# EAGLE schematic stm v0.4 (EAGLE 9.4.2)
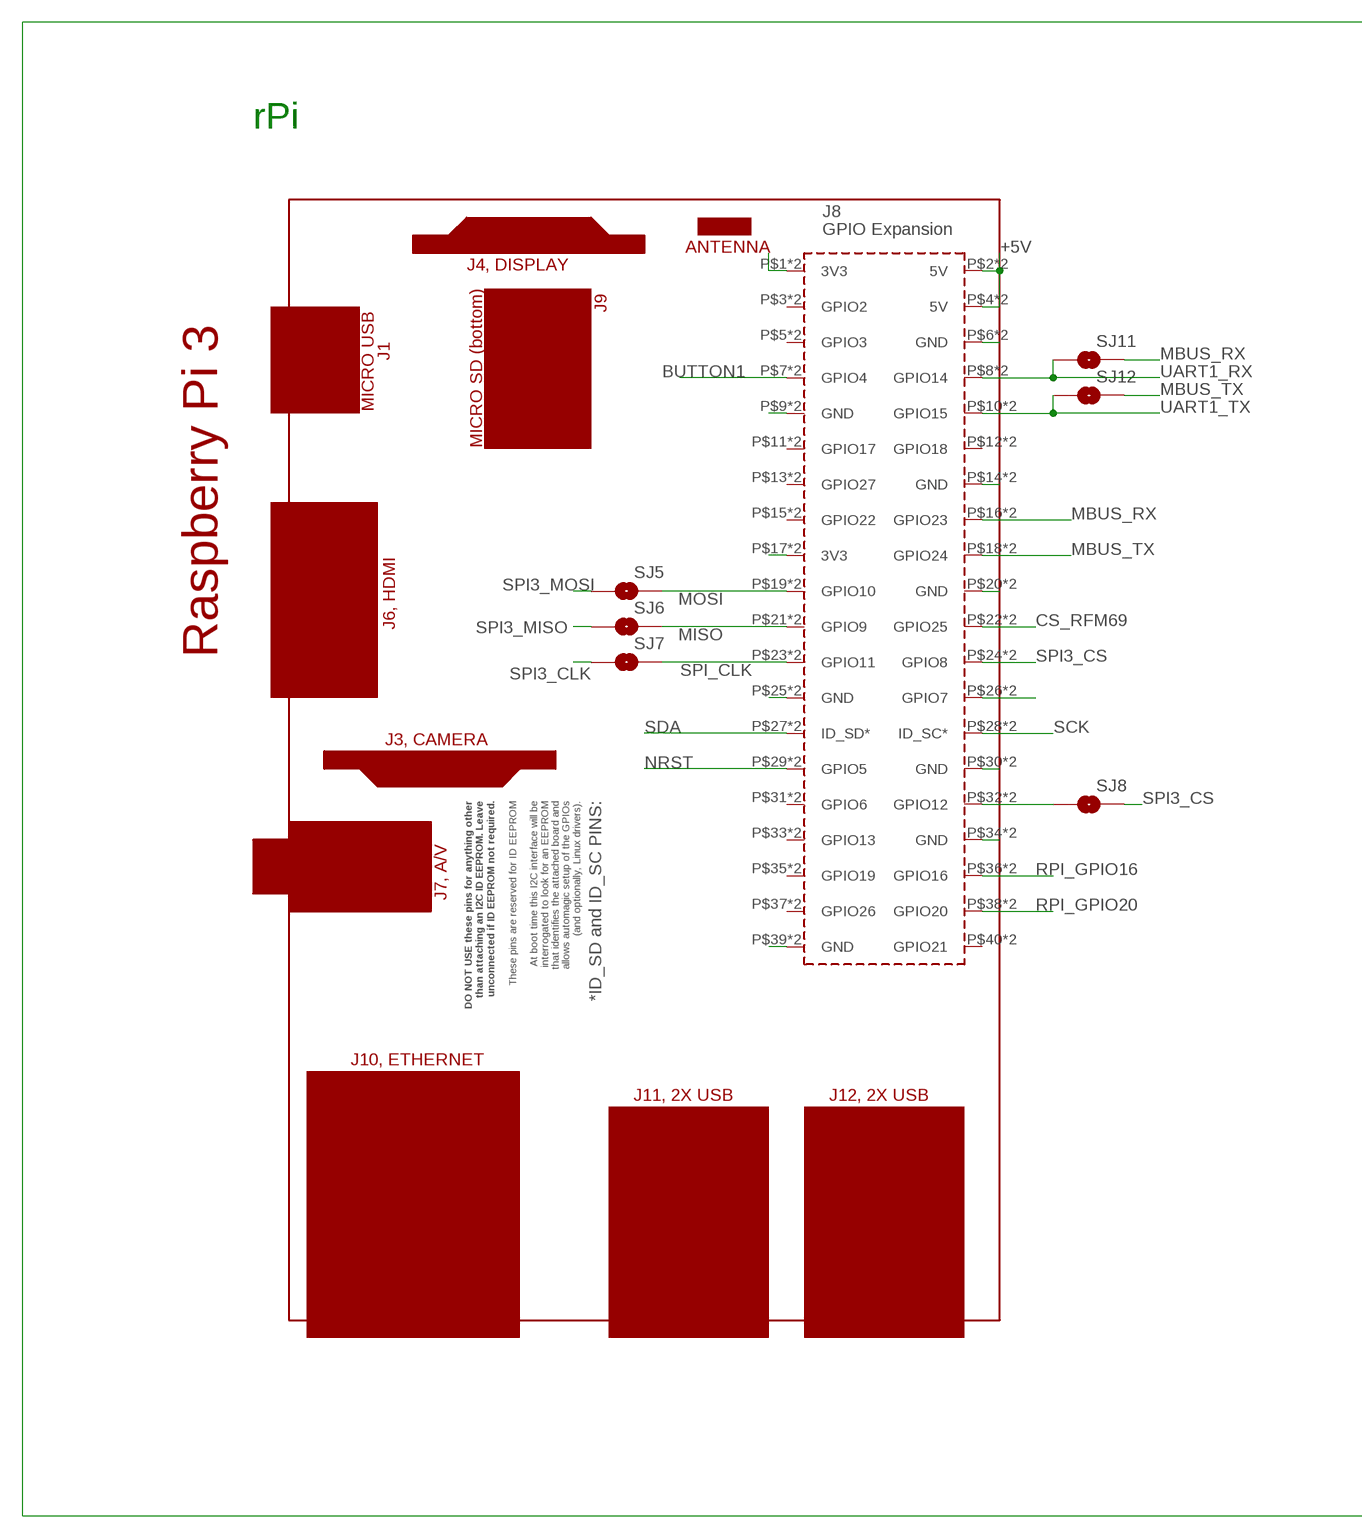
[diagram p0: schematic, sheet 1, part 1 of 2]
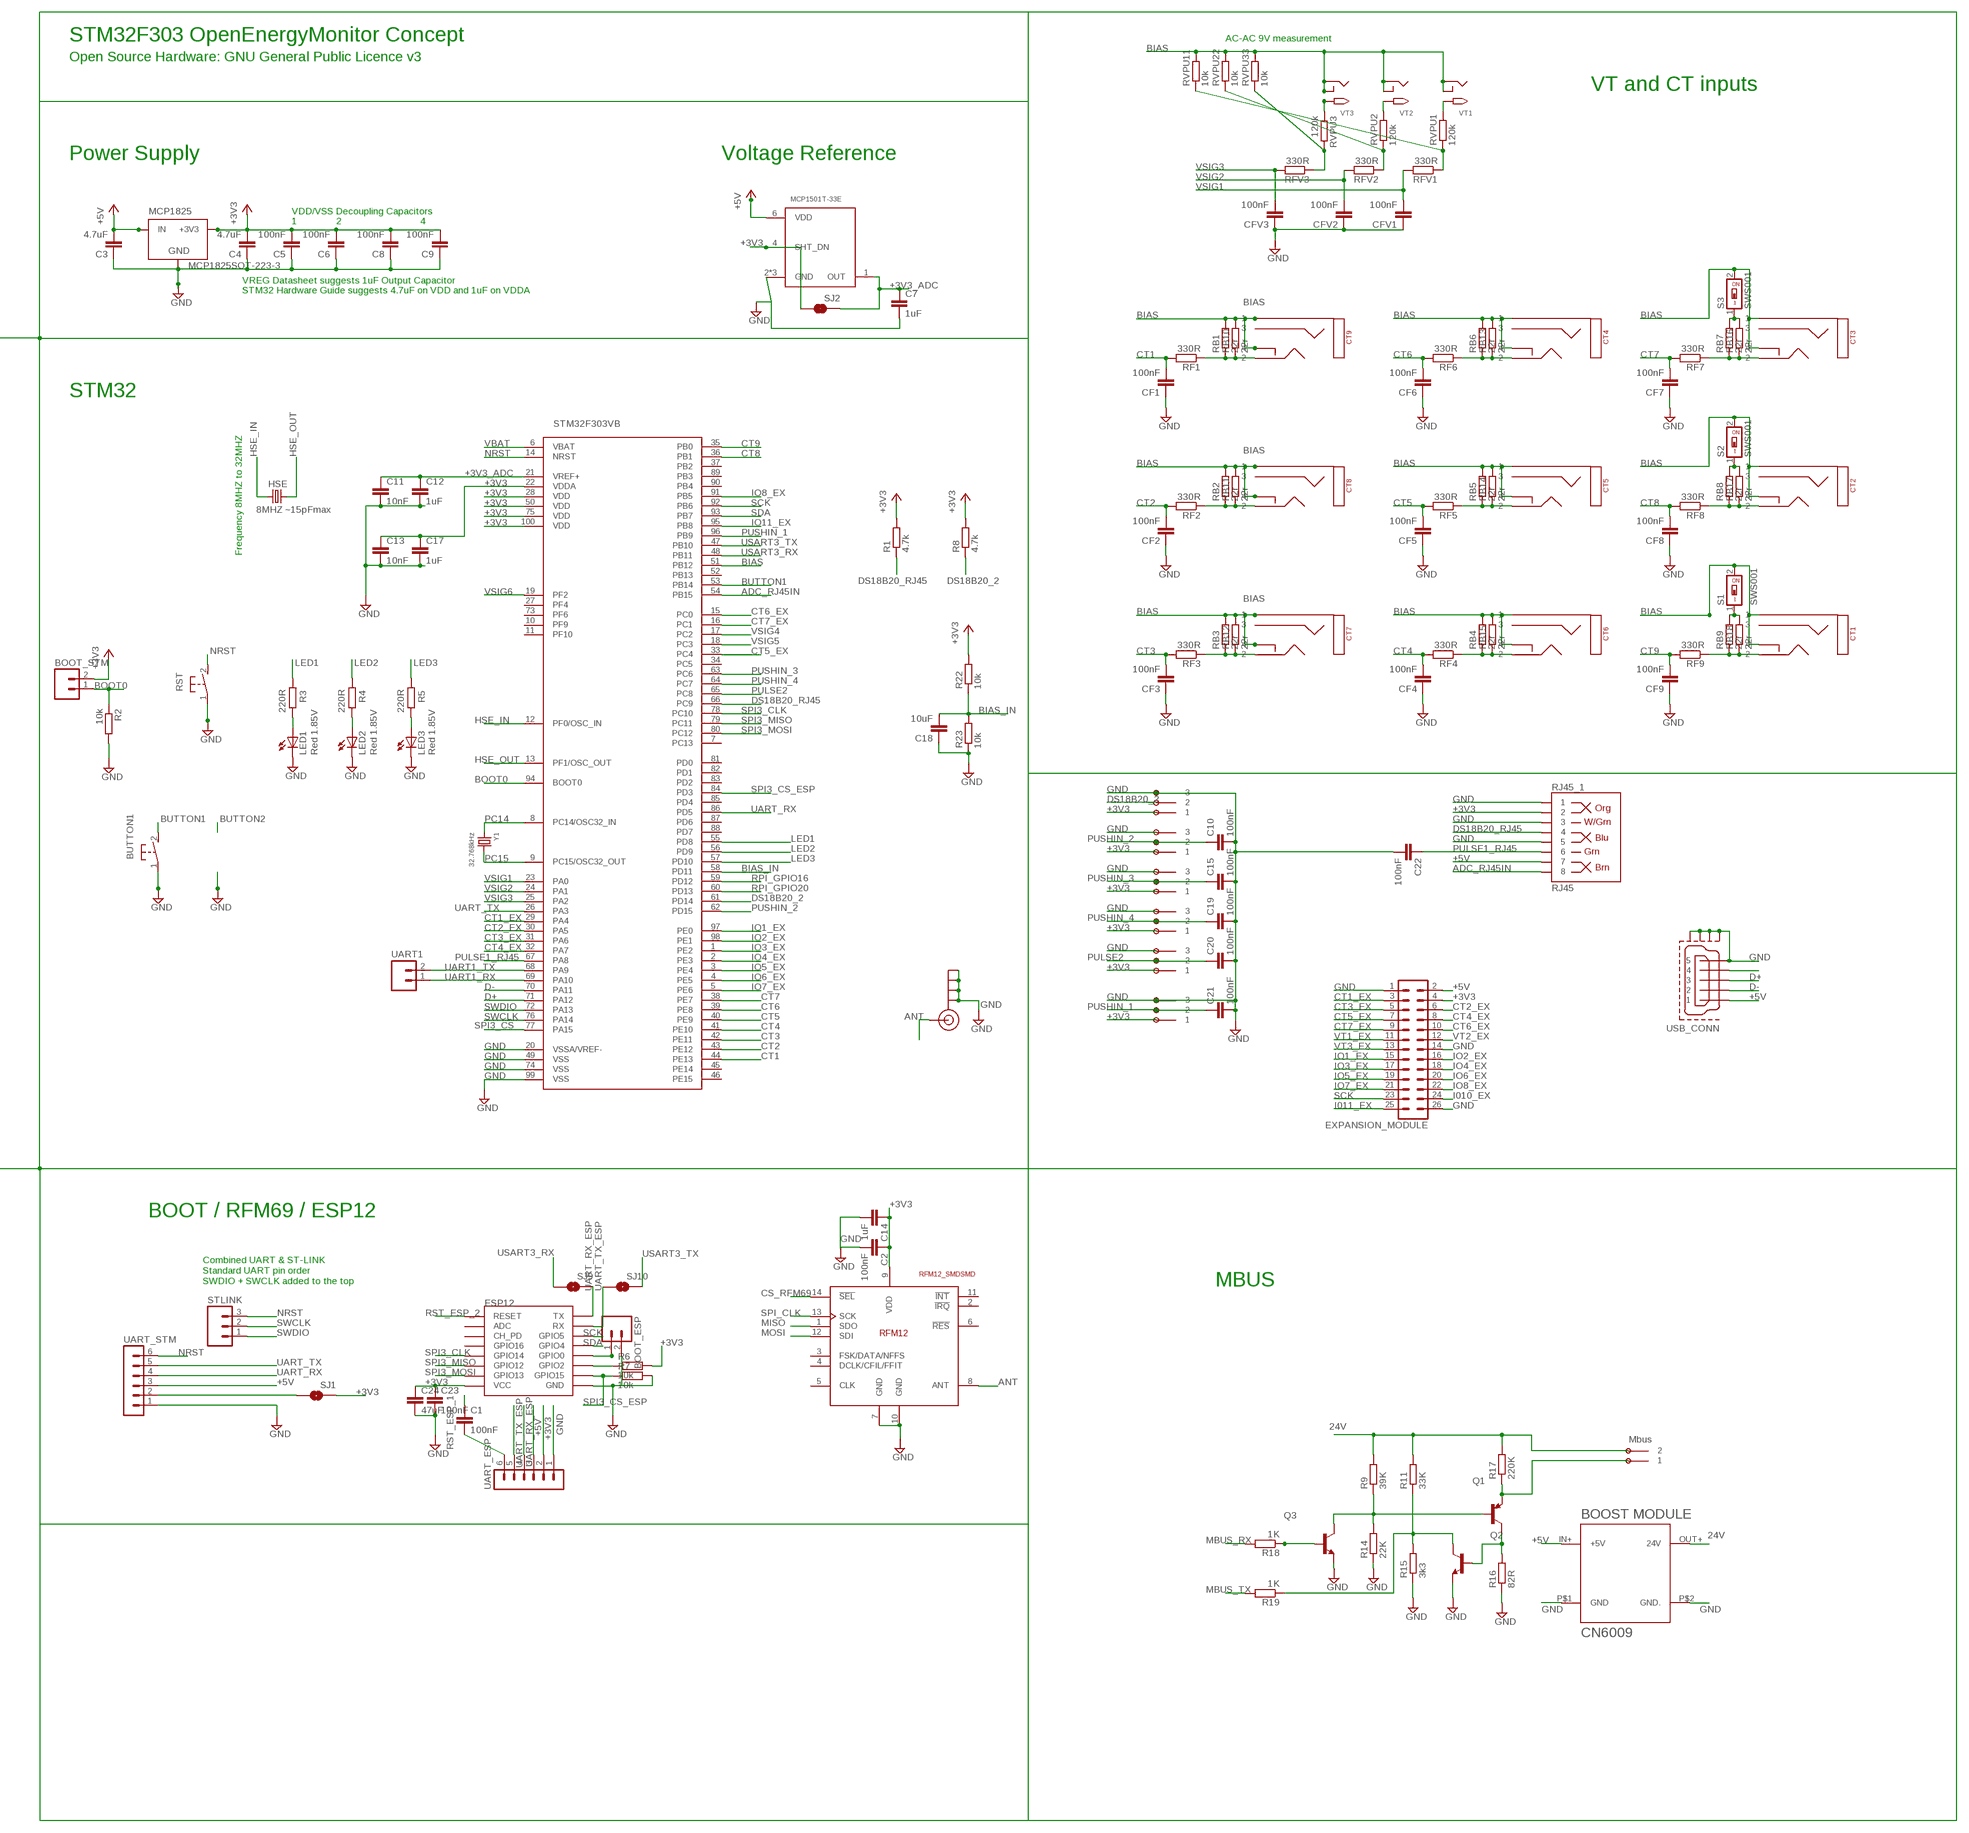
[diagram p1: schematic, sheet 1, part 2 of 2]

## Parts
2POLE_MBUS  OMNIMATE_LSF_2  [OMNIMATE_LSF_2]
3POLE_1  OMNIMATE_LSF_3  [OMNIMATE_LSF_3]
3POLE_2  OMNIMATE_LSF_3  [OMNIMATE_LSF_3]
3POLE_3  OMNIMATE_LSF_3  [OMNIMATE_LSF_3]
3POLE_4  OMNIMATE_LSF_3  [OMNIMATE_LSF_3]
3POLE_5  OMNIMATE_LSF_3  [OMNIMATE_LSF_3]
3POLE_6  OMNIMATE_LSF_3  [OMNIMATE_LSF_3]
BOOT_ESP  M02PTH  [1X02]
BOOT_STM  M02PTH  [1X02]
BUTTON1  31-XX  [B3F-31XX]
C1  100nF  C-EUC0603  [C0603]
C2  100nF  C-EUC0603  [C0603]
C3  4.7uF  C-EUC0805  [C0805]
C4  4.7uF  C-EUC0805  [C0805]
C5  100nF  C-EUC0603  [C0603]
C6  100nF  C-EUC0603  [C0603]
C7  1uF  C-EUC0805  [C0805]
C8  100nF  C-EUC0603  [C0603]
C9  100nF  C-EUC0603  [C0603]
C10  100nF  C-EUC0603  [C0603]
C11  10nF  C-EUC0603  [C0603]
C12  1uF  C-EUC0603  [C0603]
C13  10nF  C-EUC0603  [C0603]
C14  1uF  C-EUC0805  [C0805]
C15  100nF  C-EUC0603  [C0603]
C17  1uF  C-EUC0603  [C0603]
C18  10uF  C-EUC0603  [C0603]
C19  100nF  C-EUC0603  [C0603]
C20  100nF  C-EUC0603  [C0603]
C21  100nF  C-EUC0603  [C0603]
C22  100nF  C-EUC0603  [C0603]
C23  100nF  C-EUC0603  [C0603]
C24  47uF  C-EUC0805  [C0805]
CF1  100nF  C-EUC0603  [C0603]
CF2  100nF  C-EUC0603  [C0603]
CF3  100nF  C-EUC0603  [C0603]
CF4  100nF  C-EUC0603  [C0603]
CF5  100nF  C-EUC0603  [C0603]
CF6  100nF  C-EUC0603  [C0603]
CF7  100nF  C-EUC0603  [C0603]
CF8  100nF  C-EUC0603  [C0603]
CF9  100nF  C-EUC0603  [C0603]
CFV1  100nF  C-EUC0603  [C0603]
CFV2  100nF  C-EUC0603  [C0603]
CFV3  100nF  C-EUC0603  [C0603]
CT1  STEREO_SMD  [STEREO_SMT]
CT2  STEREO_SMD  [STEREO_SMT]
CT3  STEREO_SMD  [STEREO_SMT]
CT4  STEREO_SMD  [STEREO_SMT]
CT5  STEREO_SMD  [STEREO_SMT]
CT6  STEREO_SMD  [STEREO_SMT]
CT7  STEREO_SMD  [STEREO_SMT]
CT8  STEREO_SMD  [STEREO_SMT]
CT9  STEREO_SMD  [STEREO_SMT]
ESP12  ESP12SMD  [ESP12-SMD]
EXPANSION_MODULE  MA13-2  [MA13-2]
HSE  8MHZ ~15pFmax  CRYSTALCTS406  [CTS406]
J$1  SMA_EDGE  [SMA-EDGE]
LED1  Red 1.85V  LEDCHIP-LED0805  [CHIP-LED0805]
LED2  Red 1.85V  LEDCHIP-LED0805  [CHIP-LED0805]
LED3  Red 1.85V  LEDCHIP-LED0805  [CHIP-LED0805]
MCP1825  MCP1825SOT-223-3  [SOT-223]
PCB2  RPI3YA  [RPI3MIRROR2]
Q1  MMBT3906  [SOT23]
Q2  MMBT3904  [SOT23]
Q3  MMBT3904  [SOT23]
R1  4.7k  R-EU_R0603  [R0603]
R2  10k  R-EU_R0603  [R0603]
R3  220R  R-EU_R0603  [R0603]
R4  220R  R-EU_R0603  [R0603]
R5  220R  R-EU_R0603  [R0603]
R6  10k  R-EU_R0603  [R0603]
R7  10k  R-EU_R0603  [R0603]
R8  4.7k  R-EU_R0603  [R0603]
R9  39K  R-EU_R0603  [R0603]
R11  33K  R-EU_R0603  [R0603]
R14  22K  R-EU_R0603  [R0603]
R15  3k3  R-EU_R0603  [R0603]
R16  82R  R-EU_R0603  [R0603]
R17  220K  R-EU_R0603  [R0603]
R18  1K  R-EU_R0603  [R0603]
R19  1K  R-EU_R0603  [R0603]
R22  10k  R-EU_R0603  [R0603]
R23  10k  R-EU_R0603  [R0603]
RB1  22r  R-EU_R0603  [R0603]
RB2  22r  R-EU_R0603  [R0603]
RB3  22r  R-EU_R0603  [R0603]
RB4  22r  R-EU_R0603  [R0603]
RB5  22r  R-EU_R0603  [R0603]
RB6  22r  R-EU_R0603  [R0603]
RB7  22r  R-EU_R0603  [R0603]
RB8  22r  R-EU_R0603  [R0603]
RB9  22r  R-EU_R0603  [R0603]
RB10  22r  R-EU_0207/7  [0207/7]
RB11  22r  R-EU_0207/7  [0207/7]
RB12  22r  R-EU_0207/7  [0207/7]
RB13  22r  R-EU_0207/7  [0207/7]
RB14  22r  R-EU_0207/7  [0207/7]
RB15  22r  R-EU_0207/7  [0207/7]
RB16  22r  R-EU_0207/7  [0207/7]
RB17  22r  R-EU_0207/7  [0207/7]
RB18  22r  R-EU_0207/7  [0207/7]
RF1  330R  R-EU_R0603  [R0603]
RF2  330R  R-EU_R0603  [R0603]
RF3  330R  R-EU_R0603  [R0603]
RF4  330R  R-EU_R0603  [R0603]
RF5  330R  R-EU_R0603  [R0603]
RF6  330R  R-EU_R0603  [R0603]
RF7  330R  R-EU_R0603  [R0603]
RF8  330R  R-EU_R0603  [R0603]
RF9  330R  R-EU_R0603  [R0603]
RFM69HCW  RFM12_SMDSMD  [RFM12]
RFV1  330R  R-EU_R0603  [R0603]
RFV2  330R  R-EU_R0603  [R0603]
RFV3  330R  R-EU_R0603  [R0603]
RJ45_1  RJ45  RJ45-8  [RJ45-8]
RST  31-XX  [B3F-31XX]
RVPU1  120k  R-EU_R0603  [R0603]
RVPU2  120k  R-EU_R0603  [R0603]
RVPU3  120k  R-EU_R0603  [R0603]
RVPU11  10k  R-EU_R0603  [R0603]
RVPU22  10k  R-EU_R0603  [R0603]
RVPU33  10k  R-EU_R0603  [R0603]
S1  SWS001  [SMS-001]
S2  SWS001  [SMS-001]
S3  SWS001  [SMS-001]
SJ1  SOLDERJUMPERNO  [SJ_2S-NO]
SJ2  SOLDERJUMPERNO  [SJ_2S-NO]
SJ5  SOLDERJUMPERNO  [SJ_2S-NO]
SJ6  SOLDERJUMPERNO  [SJ_2S-NO]
SJ7  SOLDERJUMPERNO  [SJ_2S-NO]
SJ8  SOLDERJUMPERNO  [SJ_2S-NO]
SJ9  SOLDERJUMPERNO  [SJ_2S-NO]
SJ10  SOLDERJUMPERNO  [SJ_2S-NO]
SJ11  SOLDERJUMPERNO  [SJ_2S-NO]
SJ12  SOLDERJUMPERNO  [SJ_2S-NO]
STLINK  M03PTH  [1X03]
STM32F303VB  STM32F303XB  [TQFP100]
U$2  BOOST_MODULE  [BOOST]
UART1  M02PTH  [1X02]
UART_ESP  MA06-1  [MA06-1]
UART_STM  MA06-1  [MA06-1]
USB_CONN  MICRO-USB-RECEPTACLE47589-0001  [47589-0001]
VREF_3V3  MCP1501T-33E  [SOT95P280X145-6N]
VT1  2.1MMJACKSMT  [DCJACK_2MM_SMT]
VT2  2.1MMJACKSMT  [DCJACK_2MM_SMT]
VT3  2.1MMJACKSMT  [DCJACK_2MM_SMT]
Y1  32.768kHz  CRYSTAL8X3.8SMT  [CRYSTAL_8X3.8]

## Nets
24V: 2POLE_MBUS.P$3 2POLE_MBUS.P$4 R9.2 R11.2 R17.2 U$2.OUT+(24V)
+3V3 [power]: 3POLE_1.P$1 3POLE_1.P$2 3POLE_2.P$1 3POLE_2.P$2 3POLE_3.P$1 3POLE_3.P$2 3POLE_4.P$1 3POLE_4.P$2 3POLE_5.P$1 3POLE_5.P$2 3POLE_6.P$1 3POLE_6.P$2 BOOT_STM.2 C2.1 C4.2 C5.2 C6.2 C8.2 C9.2 C13.1 C14.1 C17.1 C23.1 C24.1 ESP12.VCC EXPANSION_MODULE.4 MCP1825.3(+3V3) R1.2 R6.2 R8.2 R22.2 RFM69HCW.9(VDD) RJ45_1.2 SJ1.2 SJ2.1 STM32F303VB.22(VDDA) STM32F303VB.28(VDD) STM32F303VB.50(VDD) STM32F303VB.75(VDD) STM32F303VB.100(VDD) UART_ESP.2 VREF_3V3.4(SHT_DN)
+3V3_ADC: C7.1 C11.1 C12.1 SJ2.2 STM32F303VB.21(VREF+) VREF_3V3.1(OUT)
+5V [power]: C3.2 EXPANSION_MODULE.2 MCP1825.1(IN) PCB2.P$2(5V) PCB2.P$4(5V) PCB2.P$42(5V) PCB2.P$44(5V) RJ45_1.7 U$2.IN+(+5V) UART_ESP.3 UART_STM.3 USB_CONN.1 VREF_3V3.6(VDD)
AC1: RVPU1.2 VT1.PWR2(TIP)
AC2: RVPU2.2 VT2.PWR2(TIP)
AC3: RVPU3.1 VT3.PWR2(TIP)
ADC0: RFV3.1 RVPU3.2 RVPU33.1
ADC_RJ45IN: RJ45_1.8 STM32F303VB.54(PB15)
ANT: J$1.SIG(SIGNAL) RFM69HCW.8(ANT)
BIAS: CT1.P$1 CT1.P$4 CT2.P$1 CT2.P$4 CT3.P$1 CT3.P$4 CT4.P$1 CT4.P$4 CT5.P$1 CT5.P$4 CT6.P$1 CT6.P$4 CT7.P$1 CT7.P$4 CT8.P$1 CT8.P$4 CT9.P$1 CT9.P$4 RB1.2 RB2.2 RB3.2 RB4.2 RB5.2 RB6.2 RB10.2 RB11.2 RB12.2 RB13.2 RB14.2 RB15.2 RVPU11.2 RVPU22.2 RVPU33.2 S1.2 S2.2 S3.2 STM32F303VB.51(PB12) VT1.GND(RING) VT1.GNDBREAK(RING_SW) VT2.GND(RING) VT2.GNDBREAK(RING_SW) VT3.GND(RING) VT3.GNDBREAK(RING_SW)
BIAS_IN: C18.2 R22.1 R23.2 STM32F303VB.58(PD11)
BOOT0: BOOT_STM.1 R2.1 STM32F303VB.94(BOOT0)
BUTTON1: BUTTON1.2(S) PCB2.P$7(GPIO4) PCB2.P$47(GPIO4) STM32F303VB.53(PB14)
CS_RFM69: PCB2.P$22(GPIO25) PCB2.P$62(GPIO25) RFM69HCW.14(!SEL)
CT1: CF1.2 RF1.2 STM32F303VB.44(PE13)
CT1_EX: EXPANSION_MODULE.3 STM32F303VB.29(PA4)
CT2: CF2.2 RF2.2 STM32F303VB.43(PE12)
CT2_EX: EXPANSION_MODULE.6 STM32F303VB.30(PA5)
CT3: CF3.2 RF3.2 STM32F303VB.42(PE11)
CT3_EX: EXPANSION_MODULE.5 STM32F303VB.31(PA6)
CT4: CF4.2 RF4.2 STM32F303VB.41(PE10)
CT4_EX: EXPANSION_MODULE.8 STM32F303VB.32(PA7)
CT5: CF5.2 RF5.2 STM32F303VB.40(PE9)
CT5_EX: EXPANSION_MODULE.7 STM32F303VB.33(PC4)
CT6: CF6.2 RF6.2 STM32F303VB.39(PE8)
CT6_EX: EXPANSION_MODULE.10 STM32F303VB.15(PC0)
CT7: CF7.2 RF7.2 STM32F303VB.38(PE7)
CT7_EX: EXPANSION_MODULE.9 STM32F303VB.16(PC1)
CT8: CF8.2 RF8.2 STM32F303VB.36(PB1)
CT9: CF9.2 RF9.2 STM32F303VB.35(PB0)
D+: STM32F303VB.71(PA12) USB_CONN.3
D-: STM32F303VB.70(PA11) USB_CONN.2
DS18B20_2: 3POLE_1.P$3 3POLE_1.P$4 R8.1 STM32F303VB.61(PD14)
DS18B20_RJ45: R1.1 RJ45_1.4 STM32F303VB.66(PC9)
GND [power]: 3POLE_1.P$5 3POLE_1.P$6 3POLE_2.P$5 3POLE_2.P$6 3POLE_3.P$5 3POLE_3.P$6 3POLE_4.P$5 3POLE_4.P$6 3POLE_5.P$5 3POLE_5.P$6 3POLE_6.P$5 3POLE_6.P$6 BOOT_ESP.2 BUTTON1.1(P) C2.2 C3.1 C4.1 C5.1 C6.1 C7.2 C8.1 C9.1 C10.2 C11.2 C12.2 C13.2 C14.2 C15.2 C17.2 C18.1 C19.2 C20.2 C21.2 C22.2 C23.2 C24.2 CF1.1 CF2.1 CF3.1 CF4.1 CF5.1 CF6.1 CF7.1 CF8.1 CF9.1 CFV1.1 CFV2.1 CFV3.1 ESP12.GND EXPANSION_MODULE.1 EXPANSION_MODULE.14 EXPANSION_MODULE.26 J$1.GND@0(GND) J$1.GND@1(GND) J$1.GND@2(GND) J$1.GND@3(GND) LED1.C LED2.C LED3.C MCP1825.2(GND) MCP1825.4(GND) PCB2.P$6(GND) PCB2.P$9(GND) PCB2.P$14(GND) PCB2.P$20(GND) PCB2.P$25(GND) PCB2.P$30(GND) PCB2.P$34(GND) PCB2.P$39(GND) PCB2.P$46(GND) PCB2.P$49(GND) PCB2.P$54(GND) PCB2.P$60(GND) PCB2.P$65(GND) PCB2.P$70(GND) PCB2.P$74(GND) PCB2.P$79(GND) Q2.2(E) Q3.2(E) R2.2 R7.2 R14.1 R15.1 R16.1 R23.1 RFM69HCW.7(GND) RFM69HCW.10(GND) RJ45_1.1 RJ45_1.3 RJ45_1.5 RST.1(P) STM32F303VB.20(VSSA/VREF-) STM32F303VB.49(VSS) STM32F303VB.74(VSS) STM32F303VB.99(VSS) U$2.P$1(GND) U$2.P$2(GND.) UART_ESP.1 UART_STM.1 USB_CONN.5 USB_CONN.CASING1(GND1) USB_CONN.CASING2(GND2) USB_CONN.CASING3(GND3) USB_CONN.CASING4(GND4) VREF_3V3.2(GND) VREF_3V3.3(GND) VREF_3V3.5(GND)
HSE_IN: HSE.1 STM32F303VB.12(PF0/OSC_IN)
HSE_OUT: HSE.3 STM32F303VB.13(PF1/OSC_OUT)
I010_EX: EXPANSION_MODULE.24
I011_EX: EXPANSION_MODULE.25
IO1_EX: EXPANSION_MODULE.15 STM32F303VB.97(PE0)
IO2_EX: EXPANSION_MODULE.16 STM32F303VB.98(PE1)
IO3_EX: EXPANSION_MODULE.17 STM32F303VB.1(PE2)
IO4_EX: EXPANSION_MODULE.18 STM32F303VB.2(PE3)
IO5_EX: EXPANSION_MODULE.19 STM32F303VB.3(PE4)
IO6_EX: EXPANSION_MODULE.20 STM32F303VB.4(PE5)
IO7_EX: EXPANSION_MODULE.21 STM32F303VB.5(PE6)
IO8_EX: EXPANSION_MODULE.22 STM32F303VB.91(PB5)
IO11_EX: STM32F303VB.95(PB8)
LED1: R3.2 STM32F303VB.55(PD8)
LED2: R4.2 STM32F303VB.56(PD9)
LED3: R5.2 STM32F303VB.57(PD10)
MBUS_RX: PCB2.P$16(GPIO23) PCB2.P$56(GPIO23) R18.2 SJ11.2
MBUS_TX: PCB2.P$18(GPIO24) PCB2.P$58(GPIO24) R19.2 SJ12.2
MISO: PCB2.P$21(GPIO9) PCB2.P$61(GPIO9) RFM69HCW.1(SDO) SJ6.2
MOSI: PCB2.P$19(GPIO10) PCB2.P$59(GPIO10) RFM69HCW.12(SDI) SJ5.2
N$1: SJ1.1 UART_STM.2
N$2: CT9.P$2 RB1.1 RB10.1 RF1.1
N$5: LED2.A R4.1
N$6: LED3.A R5.1
N$7: BOOT_ESP.1 ESP12.GPIO0
N$8: CT8.P$2 RB2.1 RB11.1 RF2.1
N$10: CT7.P$2 RB3.1 RB12.1 RF3.1
N$11: ESP12.GPIO2 R6.1
N$12: USB_CONN.4
N$13: PCB2.P$26(GPIO7) PCB2.P$66(GPIO7)
N$16: PCB2.P$32(GPIO12) PCB2.P$72(GPIO12) SJ8.1
N$22: PCB2.P$1(3V3) PCB2.P$41(3V3)
N$24: PCB2.P$17(3V3) PCB2.P$57(3V3)
N$26: RB9.2 RB18.2 S1.1
N$27: RB8.2 RB17.2 S2.1
N$28: RB7.2 RB16.2 S3.1
N$29: 2POLE_MBUS.P$1 2POLE_MBUS.P$2 Q1.2(E) R17.1
N$30: Q1.3(C) Q2.1(B) R16.2
N$31: Q1.1(B) Q3.3(C) R9.1 R14.2
N$32: Q2.3(C) R11.1 R15.2 R19.1
N$33: Q3.1(B) R18.1
N$34: RFV2.1 RVPU2.1 RVPU22.1
N$37: RFV1.1 RVPU1.1 RVPU11.1
N$38: CT6.P$2 RB4.1 RB15.1 RF4.1
N$39: CT5.P$2 RB5.1 RB14.1 RF5.1
N$40: CT4.P$2 RB6.1 RB13.1 RF6.1
N$41: LED1.A R3.1
N$42: CT3.P$2 RB7.1 RB16.1 RF7.1
N$43: CT2.P$2 RB8.1 RB17.1 RF8.1
N$44: CT1.P$2 RB9.1 RB18.1 RF9.1
NRST: PCB2.P$29(GPIO5) PCB2.P$69(GPIO5) RST.2(S) STLINK.3 STM32F303VB.14(NRST) UART_STM.6
PC14: STM32F303VB.8(PC14/OSC32_IN) Y1.P$1
PC15: STM32F303VB.9(PC15/OSC32_OUT) Y1.P$4
PULSE1_RJ45: C22.1 RJ45_1.6 STM32F303VB.67(PA8)
PULSE2: 3POLE_5.P$3 3POLE_5.P$4 C20.1 STM32F303VB.65(PC8)
PUSHIN_1: 3POLE_6.P$3 3POLE_6.P$4 C21.1 STM32F303VB.96(PB9)
PUSHIN_2: 3POLE_2.P$3 3POLE_2.P$4 C10.1 STM32F303VB.62(PD15)
PUSHIN_3: 3POLE_3.P$3 3POLE_3.P$4 C15.1 STM32F303VB.63(PC6)
PUSHIN_4: 3POLE_4.P$3 3POLE_4.P$4 C19.1 STM32F303VB.64(PC7)
RPI_GPIO16: PCB2.P$36(GPIO16) PCB2.P$76(GPIO16) STM32F303VB.59(PD12)
RPI_GPIO20: PCB2.P$38(GPIO20) PCB2.P$78(GPIO20) STM32F303VB.60(PD13)
RST_ESP_1: C1.2 UART_ESP.6
RST_ESP_2: C1.1 ESP12.RESET
SCK: ESP12.GPIO5 EXPANSION_MODULE.23 PCB2.P$28(ID_SC*) PCB2.P$68(ID_SC*) STM32F303VB.92(PB6)
SDA: ESP12.GPIO4 PCB2.P$27(ID_SD*) PCB2.P$67(ID_SD*) STM32F303VB.93(PB7)
SPI3_CLK: ESP12.GPIO14 SJ7.1 STM32F303VB.78(PC10)
SPI3_CS: PCB2.P$24(GPIO8) PCB2.P$64(GPIO8) SJ8.2 STM32F303VB.77(PA15)
SPI3_CS_ESP: ESP12.GPIO15 R7.1 STM32F303VB.84(PD3)
SPI3_MISO: ESP12.GPIO12 SJ6.1 STM32F303VB.79(PC11)
SPI3_MOSI: ESP12.GPIO13 SJ5.1 STM32F303VB.80(PC12)
SPI_CLK: PCB2.P$23(GPIO11) PCB2.P$63(GPIO11) RFM69HCW.13(SCK) SJ7.2
SWCLK: STLINK.2 STM32F303VB.76(PA14)
SWDIO: STLINK.1 STM32F303VB.72(PA13)
UART1_RX: PCB2.P$8(GPIO14) PCB2.P$48(GPIO14) SJ11.1 STM32F303VB.69(PA10) UART1.1
UART1_TX: PCB2.P$10(GPIO15) PCB2.P$50(GPIO15) SJ12.1 STM32F303VB.68(PA9) UART1.2
UART_RX: STM32F303VB.86(PD5) UART_STM.4
UART_RX_ESP: ESP12.TXD0(TX) SJ9.2 UART_ESP.4
UART_TX: STM32F303VB.26(PA3) UART_STM.5
UART_TX_ESP: ESP12.RXD0(RX) SJ10.1 UART_ESP.5
USART3_RX: SJ9.1 STM32F303VB.48(PB11)
USART3_TX: SJ10.2 STM32F303VB.47(PB10)
VBAT: STM32F303VB.6(VBAT)
VSIG1: CFV1.2 RFV1.2 STM32F303VB.23(PA0)
VSIG2: CFV2.2 RFV2.2 STM32F303VB.24(PA1)
VSIG3: CFV3.2 RFV3.2 STM32F303VB.25(PA2)
VSIG4: STM32F303VB.17(PC2)
VSIG5: STM32F303VB.18(PC3)
VSIG6: STM32F303VB.19(PF2)
VT1_EX: EXPANSION_MODULE.11
VT2_EX: EXPANSION_MODULE.12
VT3_EX: EXPANSION_MODULE.13
Unconnected: CT1.P$3 CT2.P$3 CT3.P$3 CT4.P$3 CT5.P$3 CT6.P$3 CT7.P$3 CT8.P$3 CT9.P$3 ESP12.ADC ESP12.CH_PD ESP12.GPIO16 PCB2.P$3(GPIO2) PCB2.P$5(GPIO3) PCB2.P$11(GPIO17) PCB2.P$12(GPIO18) PCB2.P$13(GPIO27) PCB2.P$15(GPIO22) PCB2.P$31(GPIO6) PCB2.P$33(GPIO13) PCB2.P$35(GPIO19) PCB2.P$37(GPIO26) PCB2.P$40(GPIO21) PCB2.P$43(GPIO2) PCB2.P$45(GPIO3) PCB2.P$51(GPIO17) PCB2.P$52(GPIO18) PCB2.P$53(GPIO27) PCB2.P$55(GPIO22) PCB2.P$71(GPIO6) PCB2.P$73(GPIO13) PCB2.P$75(GPIO19) PCB2.P$77(GPIO26) PCB2.P$80(GPIO21) RFM69HCW.2(!IRQ) RFM69HCW.3(FSK/DATA/NFFS) RFM69HCW.4(DCLK/CFIL/FFIT) RFM69HCW.5(CLK) RFM69HCW.6(!RES) RFM69HCW.11(!INT) STM32F303VB.7(PC13) STM32F303VB.10(PF9) STM32F303VB.11(PF10) STM32F303VB.27(PF4) STM32F303VB.34(PC5) STM32F303VB.37(PB2) STM32F303VB.45(PE14) STM32F303VB.46(PE15) STM32F303VB.52(PB13) STM32F303VB.73(PF6) STM32F303VB.81(PD0) STM32F303VB.82(PD1) STM32F303VB.83(PD2) STM32F303VB.85(PD4) STM32F303VB.87(PD6) STM32F303VB.88(PD7) STM32F303VB.89(PB3) STM32F303VB.90(PB4)

## Notes on the sheet
- STM32F303 OpenEnergyMonitor Concept | AC-AC 9V measurement
- Open Source Hardware: GNU General Public Licence v3
- VT and CT inputs
- Power Supply | Voltage Reference
- VDD/VSS Decoupling Capacitors
- 1 | 2 | 4
- VREG Datasheet suggests 1uF Output Capacitor
- STM32 Hardware Guide suggests 4.7uF on VDD and 1uF on VDDA
- rPi | STM32
- Frequency 8MHZ to 32MHZ
- BOOT / RFM69 / ESP12
- Combined UART & ST-LINK
  Standard UART pin order
  SWDIO + SWCLK added to the top
- MBUS
- Mbus

## Library data of the parts
2POLE_MBUS = OMNIMATE_LSF:OMNIMATE_LSF_2
3POLE_1-3POLE_6 = OMNIMATE_LSF:OMNIMATE_LSF_3
BOOT_ESP BOOT_STM UART1 = SparkFun:M02: Header 2 Standard 2-pin 0.1" header. Use with straight break away headers (SKU : PRT-00116), right angle break away headers (PRT-00553), swiss pins (PRT-00743), machine pins (PRT-00117), and female headers (PRT-00115). Molex polarized connector foot print use with SKU : PRT-08233 with associated crimp pins and housings.
BUTTON1 RST = switch-omron:31-XX: OMRON SWITCH; MPN: B3F-3100; OC_FARNELL: 959704; OC_NEWARK: 36M3582
C1 C2 C5 C6 C8-C10 C12 C15 C17-C23 CF1-CF9 CFV1-CFV3 = resistor:C-EU: CAPACITOR, European symbol
C3 C4 C7 C11 C13 C14 C24 = rcl:C-EU: CAPACITOR, European symbol; SPICEPREFIX: C
CT1-CT9 = IotaWatt_parts:STEREO_SMD: 3.5mm Stereo Jack SMT
ESP12 = ESP8266 MODULES _ CORRECTED:ESP12: ESP8266 Wifi module 12
EXPANSION_MODULE = con-lstb:MA13-2: PIN HEADER; OC_FARNELL: unknown; OC_NEWARK: unknown
HSE = crystal:CRYSTAL: CRYSTAL; OC_FARNELL: unknown; OC_NEWARK: unknown
J$1 = SparkFun-Connectors:SMA_EDGE: SMA Antenna Connector End launch SMA connector. The paste layer has been removed so that the connector can be hand soldered onto the board after reflow.
LED1-LED3 = adafruit:LED: LED OSRAM: - CHIPLED LG R971, LG N971, LY N971, LG Q971, LY Q971, LO R971, LY R971 LH N974, LH R974 LS Q976, LO Q976, LY Q976 LO Q996 - Hyper CHIPLED LW Q18S LB Q993, LB Q99A, LB R99A - SideLED LS A670, LO A670, LY A670, LG A670, LP A670 LB A673, LV A673, LT A673, LW A673 LH A674 LY A675 LS A676, LA A676, LO A676, LY A676, LW A676 LS A679, LY A679, LG A679 - Hyper Micro SIDELED® LS Y876, LA Y876, LO Y876, LY Y876 LT Y87S - SmartLED LW L88C, LW L88S LB L89C, LB L89S, LG L890 LS L89K, LO L89K, LY L89K LS L896, LA L896, LO L896, LY L896 - TOPLED LS T670, LO T670, LY T670, LG T670, LP T670 LSG T670, LSP T670, LSY T670, LOP T670, LYG T670 LG T671, LOG T671, LSG T671 LB T673, LV T673, LT T673, LW T673 LH T674 LS T676, LA T676, LO T676, LY T676, LB T676, LH T676, LSB T676, LW T676 LB T67C, LV T67C, LT T67C, LS T67K, LO T67K, LY T67K, LW E67C LS E67B, LA E67B, LO E67B, LY E67B, LB E67C, LV E67C, LT E67C LW T67C LS T679, LY T679, LG T679 LS T770, LO T770, LY T770, LG T770, LP T770 LB T773, LV T773, LT T773, LW T773 LH T774 LS E675, LA E675, LY E675, LS T675 LS T776, LA T776, LO T776, LY T776, LB T776 LHGB T686 LT T68C, LB T68C - Hyper Mini TOPLED® LB M676 - Mini TOPLED Santana® LG M470 LS M47K, LO M47K, LY M47K Source: http://www.osram.convergy.de/
MCP1825 = SteelCaveRobotics-Power:MCP1825: MCP1825 3.3v LDO Linear Regulator
PCB2 = e14_Rpi3_RevA+mirror-pcb copy:RPI3: Device for Raspberry Pi 3 board created by Dave Young for www.element14.com More information and support community is available at https://www.element14.com/community/community/raspberry-pi Device for Raspberry Pi 3 board updated by Gerald Schwarz for www.element14.com On RPI3 addet the layer milling and created a mirrored shield.
Q1 = Transistor:MMBT3906: TRANS PNP 40V 0.2A SOT-23; CREATED_BY: PCB Layout; DIGIKEY_PART_NUMBER: MMBT3906FSCT-ND; MANUFACTURER: ON Semiconductor; MPN: MMBT3906; PACKAGE: SOT-23
Q2 Q3 = Transistor:MMBT3904: TRANS NPN 40V 0.2A SOT-23; CREATED_BY: PCB Layout; DIGIKEY_PART_NUMBER: MMBT3904FSCT-ND; MANUFACTURER: ON Semiconductor; MPN: MMBT3904; PACKAGE: SOT-23-3
R1 R2 R6-R8 R22 R23 RB1-RB9 RF1-RF9 RFV1-RFV3 RVPU1-RVPU3 RVPU11 RVPU22 RVPU33 = resistor:R-EU_: RESISTOR, European symbol
R3-R5 R9 R11 R14-R19 RB10-RB18 = rcl:R-EU_: RESISTOR, European symbol; SPICEPREFIX: R
RFM69HCW = rfm12b _ rfm69cw:RFM12_SMD: RFM12 is a low costing ISM band transceiver module implemented with unique PLL. It works signal ranges from 315/433/868/915MHZ bands, comply with FCC, ETSI regulation. The SPI interface is used to communicate with microcontroller for parameter setting.
RJ45_1 = SparkFun-Connectors:RJ45-8: RJ45 Jack - 8 pin Simple RJ45, 8-pin connection. Commonly used for Cat5, Cat5e, and Cat6 Ethernet cables. Here is the connector we sell at SparkFun: RJ45 8-Pin Connector <https://www.sparkfun.com/products/643> (PRT-00643) Datasheet <https://cdn.sparkfun.com/datasheets/Prototyping/04908.pdf> It is used on this SparkFun product: SparkFun RJ45 Breakout <https://www.sparkfun.com/products/716> (BOB-00716) Note, you may also be interested in the "MAGJACK" version of this. It is basically a RJ45 connector, but also has some status LEDs built into the connector housing. You can check that out in this library at the device named "MAGJACK.dev" and see these products online: RJ45 Ethernet MagJack-Compatible <https://www.sparkfun.com/products/8534> (PRT-08534) SparkFun RJ45 MagJack Breakout <https://www.sparkfun.com/products/13021> (BOB-13021); PROD_ID: CONN-08506; SF_ID: PRT-00643
S1-S3 = smd-special:SWS001: SMD Dip Switch 1 pol.
SJ1 SJ2 SJ5-SJ12 = SparkFun:SOLDERJUMPER: Solder Jumper Standard SMD solder jumper. Used to automate production. Two varients : Normally Open and Normally Closed are the same, but have different paste layers. NC will have a large amount of paste and should jumper during reflow.
STLINK = SparkFun:M03: Header 3 Standard 3-pin 0.1" header. Use with straight break away headers (SKU : PRT-00116), right angle break away headers (PRT-00553), swiss pins (PRT-00743), machine pins (PRT-00117), and female headers (PRT-00115). Molex polarized connector foot print use with SKU : PRT-08232 with associated crimp pins and housings.
STM32F303VB = stm32f303:STM32F303XB
U$2 = BOOST MODULE CN6009:BOOST_MODULE
UART_ESP UART_STM = con-lstb-db:MA06-1: PIN HEADER; OC_FARNELL: unknown; OC_NEWARK: unknown
USB_CONN = con-molex-usb:MICRO-USB-RECEPTACLE: MICRO USB RECEPTACLES Micro-USB Receptacles, SMT, Lead-Free from MOLEX <http://www.molex.com/>. (C) 2014 Tomasz Boleslaw CEDRO, cederom@tlen.pl, http://www.tomek.cedro.info. Version 0.1 (2014-01-17): Initial release. Version 0.2 (2014-02-06): Updated 47589-0001 footprint pins/pads/milling. Following devices are included: 1. 47589-0001 Micro-USB AB Receptacle, Bottom Mount, SMT, Lead-Free <http://www.molex.com/molex/products/datasheet.jsp?part=active/0475890001_IO_CONNECTORS.xml> (Technical Drawing <http://www.molex.com/pdm_docs/sd/475890001_sd.pdf>).
VREF_3V3 = MCP1501T-33E:MCP1501T-33E
VT1-VT3 = adafruit:2.1MMJACK: 2.1mm x 5.5mm THM DC jack with internal switch. Digikey part #PJ-102A, 4UCON part #05537 2.1mm x 5.5mm SMT DC jack with internal switch. Digikey part #PJ-002A-SMT, 4UCON part #03267 By microbuilder.eu & adafruit.com
Y1 = microbuilder:CRYSTAL: Crystals HC49UP - Surface Mount Crystal 4.0MHz 18pF +/-30ppm Surface Mount Crystal [Digikey: 535-9857-1-ND] 12.0 MHz Surface Mount Crystal [Digikey: 535-9869-6-ND] 25.0 MHz Surface Mount Crystal [Digikey: 535-9078-1-ND] 2.5 x 2.0mm - MEMs SMT Crystal 16.0 MHz 10pF 20ppm 2.5 x 2.0mm Crystal [Digikey -40-85°C: 535-10923-1-ND] 3.2 x 2.5mm - MEMs SMT Crystal 12.0 MHz 8pF 15ppm 3.2 x 2.5mm Crystal [Digikey: -10-70°C: 644-1047-1-ND -40-125°C: 644-1128-1-ND] 16.0 MHz 8pF 15ppm 3.2 x 2.5mm Crystal [Digikey: -10-70°C: 644-1049-1-ND -40-125°C: 644-1129-2-ND] 16.0 MHz 10pF 10ppm 3.2 x 2.5mm Crystal [Digikey: 644-1100-1-ND] 27.12 MHz 18pF 30ppm 3.2 x 2.5mm Crystal [Digikey: 887-1424-1-ND] 27.12MHz 10pF 10ppm 3.2 x 2.5mm Crystal [Digikey: 887-1329-1-ND] 4.9 x 1.8mm - MEMs SMT Crystal 32.768 KHz 12.5pF 20ppm 4.9 x 1.8mm Crystal [Digikey: SE2415CT-ND] 8.0 x 3.8mm - Surface Mount Crystal 32.768kHz 12.5pF 20ppm -40°C-85°C [Digikey: 535-9166-2-ND] Cylinder 32.768KHz Cylinder Crystal (2x6mm body) [Ex. Digikey: 300-8341-2-ND]

## Net classes
0 default: width 0.203 mm, drill 0.35 mm, clearance 0.152 mm
1 power: width 0.279 mm, drill 0.35 mm, clearance 0.178 mm
2 gnd: width 0.254 mm, drill 0.35 mm, clearance 0.152 mm